# Altium schematic sheet 100046138_data_switches.SchDoc
size 863 x 558 mm; SheetNumber: 2; SheetTotal: 4
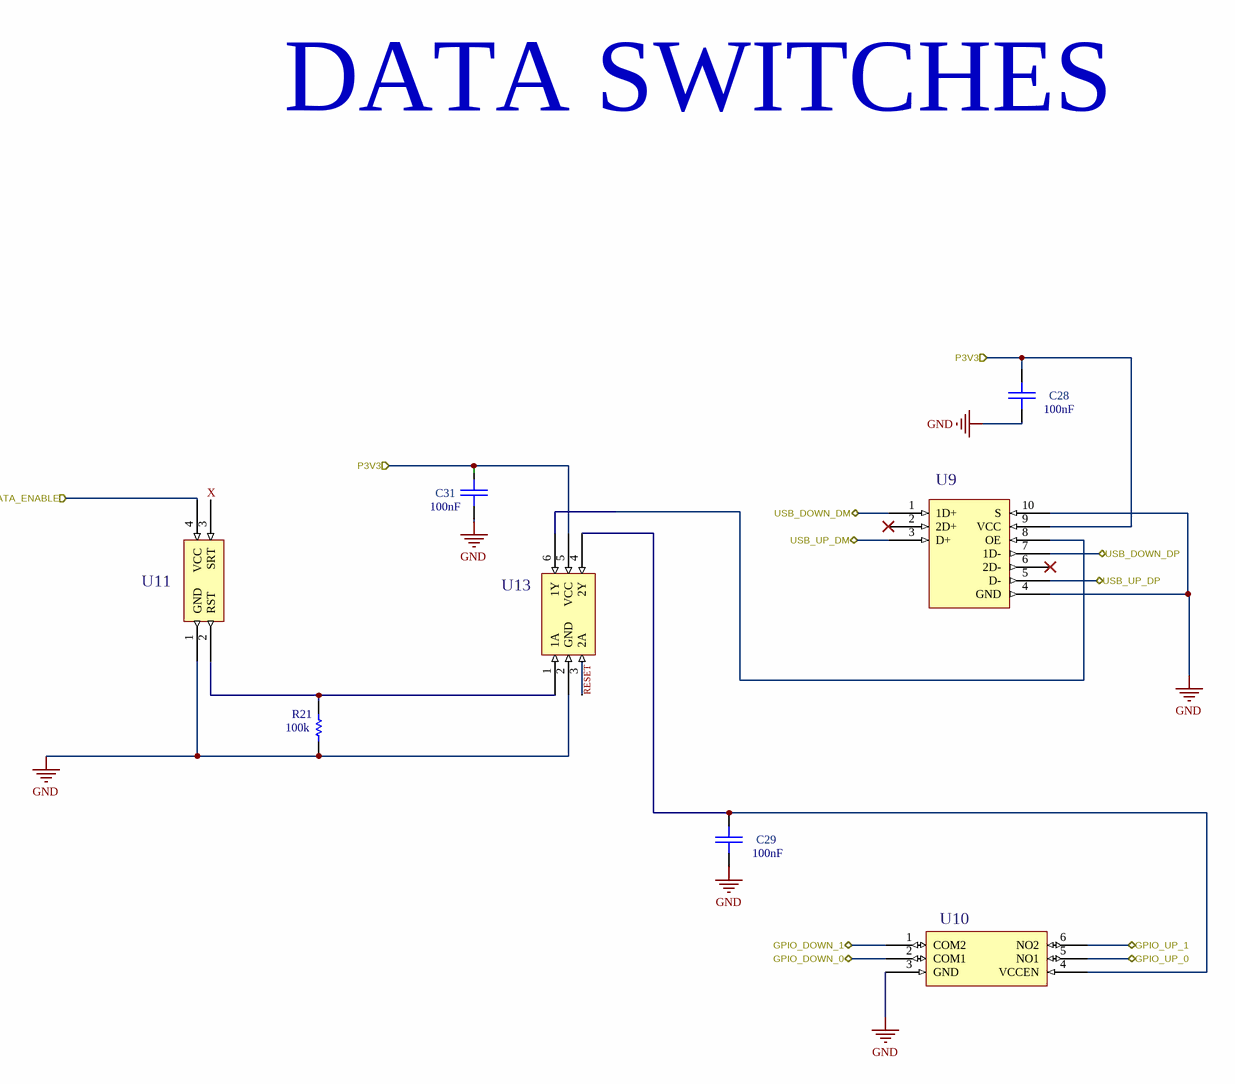
[diagram p0: 100046138_data_switches.SchDoc]

## Parts
C28  value 100nF  [CAP-0402-A]  (hidden comment: Cap 0402 100nF 10% X7R)
C29  value 100nF  [CAP-0402-A]  (hidden comment: Cap 0402 100nF 10% X7R)
C31  value 100nF  [CAP-0402-A]  (hidden comment: Cap 0402 100nF 10% X7R)
R21  value 100k  [RES-0402-C]  (hidden comment: Res 0402 100K 1/10W 1% Thick Flim)
U9  TC7USB40MU  [IC-UQFN10-A]  (value not drawn)
U10  MAX20336AEFT+T  [IC-FC2QFN-A]  (value not drawn)
U11  MAX821UUS+T  [IC-SOT143-4-A]  (value not drawn)
U13  SN74AUP2G04DRYR  [IC-SON6-A]  (value not drawn)

## Ports
DATA_ENABLE (in), GPIO_DOWN_0 (bidir), GPIO_DOWN_1 (bidir), GPIO_UP_0 (bidir), GPIO_UP_1 (bidir), P3V3 (in), USB_DOWN_DM (bidir), USB_DOWN_DP (bidir), USB_UP_DM (bidir), USB_UP_DP (bidir)

## Nets
GND: C28.1 C29.1 C31.2 R21.1 U9.4(GND) U9.10(S) U10.3(GND) U11.1(GND) U13.2(GND)
DATA_ENABLE: U11.4(VCC) ; port DATA_ENABLE
GPIO_DOWN_0: U10.2(COM1) ; port GPIO_DOWN_0
GPIO_DOWN_1: U10.1(COM2) ; port GPIO_DOWN_1
GPIO_UP_0: U10.5(NO1) ; port GPIO_UP_0
GPIO_UP_1: U10.6(NO2) ; port GPIO_UP_1
P3V3: C28.2 C31.1 U9.9(VCC) U13.5(VCC) ; port P3V3
USB_DOWN_DM: U9.1(1D+) ; port USB_DOWN_DM
USB_DOWN_DP: U9.7(1D-) ; port USB_DOWN_DP
USB_UP_DM: U9.3(D+) ; port USB_UP_DM
USB_UP_DP: U9.5(D-) ; port USB_UP_DP
NetC29_2: C29.2 U10.4(VCCEN) U13.4(2Y)
NetR21_2: R21.2 U11.2(RST) U13.1(1A)
NetU9_8: U9.8(OE) U13.6(1Y)

Not connected (* = marked no-connect by the designer): U9 2(2D+)* 6(2D-)*; U11 3(SRT); U13 3(2A)

## Notes on the sheet
- DATA SWITCHES
- (near U11) X
- Labels drawn without touching a wire or pin: RESET
- DWG NO
- REVISIONS
- SH
- REVISION
- DESCRIPTION
- DATE(YEAR-MO-DA)
- APPROVED
- PART NO.
- DESIGN ACTIVITY
- US ARMY
  COMBAT CAPABILITIES DEVELOPMENT COMMAND ARMAMENTS CENTER
  PICATINNY ARSENAL, NEW JERSEY 07806-5000
- SIZE
- CAGE CODE
- DWG NO.
- D
- 19200
- SCALE
- NONE
- UNIT WT.
- ---
- SHEET

## Library data of the parts
C28 C29 C31 = CAP-00363-2: Leader Qty: 100; UOM: EA; Voltage Rating: 50V; Footprint: Capacitor_SMD:C_0402_1005Metric; Case/Package: 0402; Max Operating Temperature: 125°C; Min Operating Temperature: -55°C; Mounting Technology: Surface Mount; Tolerance: 10%
R21 = RES-00031-9: Leader Qty: 100; Footprint: Resistor_SMD:R_0402_1005Metric; Case/Package: 0402; Max Operating Temperature: 155°C; Min Operating Temperature: -55°C; Mounting Technology: SMT; Pins: 2; RoHS Compliant: Yes; Tolerance: 1%
U9 = IC-00423-1: USB Interface, 1: 2 Multiplexer/Demultiplexer Switch, USB 2.0, 2.3 V, 4.3 V, UQFN-B, 10 Pins; Footprint: 1a_Misc:Toshiba UQFN-10_1.4x1.8mm_P0.4mm; Schedule B: 8542390000|8542390000|8542390000|8542390000|8542390000
U10 = IC-00417-1: Industry's Smallest DPST Can Switch ±5.5V Signals with a Single VCC as Low as 1.6V; Manufacturer Lifecycle Status: PRODUCTION; Footprint: 1a_Misc:FC2QFN-6; Lifecycle Status: Production; RoHS: Compliant
U11 = IC-00421-1: 4-Pin, µP Voltage Monitors with Pin-Selectable Power-On Reset Timeout Delay; Manufacturer Lifecycle Status: PRODUCTION; Max Power Dissipation: 320mW; Max Reset Threshold Voltage: 2.81V; Max Supply Current: 5.5µA; Max Supply Voltage: 5.5V; Min Reset Threshold Voltage: 2.74V; Min Supply Voltage: 1V; Nominal Supply Current: 1.8µA; Number of Outputs: 1; Output Current: 20mA; Reset: Active Low; Threshold Voltage: 2.78V; Watchdog Timer: No; Footprint: 1a_Misc:SOT-143 Maxim; Case/Package: SOT-143-4; Height: 1.22mm; Lead Free: Lead Free; Lifecycle Status: Production; Max Operating Temperature: 125°C; Min Operating Temperature: -40°C; Mounting Technology: Surface Mount; Number of Voltages Monitored: 1; Operating Supply Current: 5.5µA; Overvoltage Threshold: 2.81V; Pins: 4; Radiation Hardening: No; RoHS: Compliant; Type: Simple Reset/Power-On Reset; Undervoltage Threshold: 2.74V
U13 = IC-00422-1: IC INVERTER 2CH 2-INP 6SON Inverter IC 2 Channel 6-SON (1.45x1); Manufacturer Lifecycle Status: ACTIVE; High Level Output Current: -4mA; Logic Function: Buffer, Inverter; Low Level Output Current: 4mA; Max Supply Voltage: 3.6V; Min Supply Voltage: 800mV; Number of Bits: 2; Number of Inputs: 1; Propagation Delay: 6.2ns; Quiescent Current: 500nA; Turn-On Delay Time: 25.5ns; Footprint: 1a_Misc:QFN-6_1.4x1mm_P0.5mm TI DRY6; Height: 600µm; Lead Free: Lead Free; Length: 1.45mm; Lifecycle Status: Production; Max Operating Temperature: 85°C; Min Operating Temperature: -40°C; Mounting Technology: Surface Mount; Number of Circuits: 2; Number of Elements: 2; Number of Gates: 2; Packaging: Digi-Reel®; Pins: 6; Radiation Hardening: No; RoHS: Compliant; Thickness: 500µm; Width: 1mm